# Altium project Ser.prjpcb
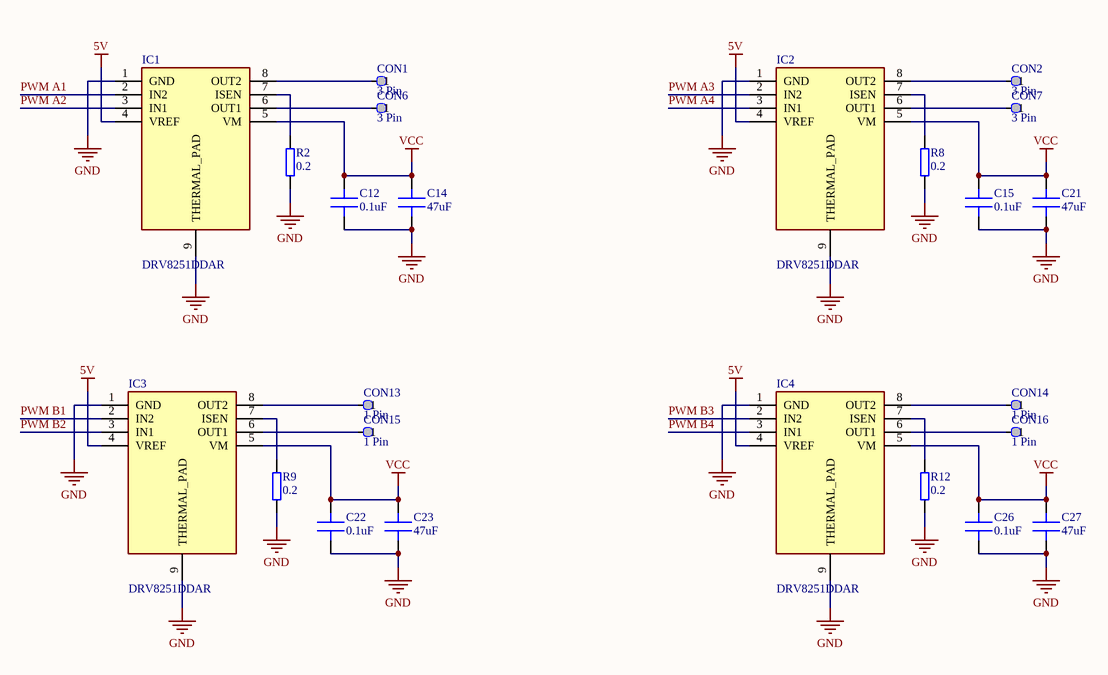
[diagram p0: dc_drivers.schdoc]
5 sheets, 110 parts. Net scope: global (net labels, ports and power ports of the same name join across sheets).
Board files: Ser_plytka.pcbdoc, v3.0_ser_plytka.PcbDoc
Sheets:
  dc_drivers.schdoc
  DC-DC.SchDoc
  Connectors-and-Filters.schdoc
  Interface1.schdoc
  MCU-and-ICs.schdoc

## Sheet dc_drivers.schdoc
size A4; SheetNumber: 1; SheetTotal: 5

### Parts
(Parts that share a designator on the sheet are numbered #1, #2 ... from top to bottom, then left to right.)
C12#1  0.1uF  [C 0402]
C14  47uF  [C 1206]
C15  0.1uF  [C 0402]
C21  47uF  [C 1206]
C22  0.1uF  [C 0402]
C23#1  47uF  [C 1206]
C26  0.1uF  [C 0402]
C27#1  47uF  [C 1206]
CON1  3 Pin  [SMD PAD]
CON2#1  3 Pin  [SMD PAD]
CON6  3 Pin  [SMD PAD]
CON7  3 Pin  [SMD PAD]
CON13  1 Pin  [SMD PAD]
CON14  1 Pin  [SMD PAD]
CON15  1 Pin  [SMD PAD]
CON16  1 Pin  [SMD PAD]
IC1#1  DRV8251DDAR  [SOIC127P600X170-9N]
IC2#1  DRV8251DDAR  [SOIC127P600X170-9N]
IC3  DRV8251DDAR  [SOIC127P600X170-9N]
IC4  DRV8251DDAR  [SOIC127P600X170-9N]
R2  0.2  [R 1206]
R8#1  0.2  [R 1206]
R9#1  0.2  [R 1206]
R12  0.2  [R 1206]

### Nets
5V: IC1#1.4(VREF) IC2#1.4(VREF) IC3.4(VREF) IC4.4(VREF)
GND: C12#1.2 C14.2 C15.2 C21.2 C22.2 C23#1.2 C26.2 C27#1.2 IC1#1.1(GND) IC1#1.9(THERMAL_PAD) IC2#1.1(GND) IC2#1.9(THERMAL_PAD) IC3.1(GND) IC3.9(THERMAL_PAD) IC4.1(GND) IC4.9(THERMAL_PAD) R2.2 R8#1.2 R9#1.2 R12.2
VCC: C12#1.1 C14.1 C15.1 C21.1 C22.1 C23#1.1 C26.1 C27#1.1 IC1#1.5(VM) IC2#1.5(VM) IC3.5(VM) IC4.5(VM)
PWM A1: IC1#1.2(IN2)
PWM A2: IC1#1.3(IN1)
PWM A3: IC2#1.2(IN2)
PWM A4: IC2#1.3(IN1)
PWM B1: IC3.2(IN2)
PWM B2: IC3.3(IN1)
PWM B3: IC4.2(IN2)
PWM B4: IC4.3(IN1)
NetCON1_1: CON1.1 IC1#1.8(OUT2)
NetCON2#1_1: CON2#1.1 IC2#1.8(OUT2)
NetCON6_1: CON6.1 IC1#1.6(OUT1)
NetCON7_1: CON7.1 IC2#1.6(OUT1)
NetCON13_1: CON13.1 IC3.8(OUT2)
NetCON14_1: CON14.1 IC4.8(OUT2)
NetCON15_1: CON15.1 IC3.6(OUT1)
NetCON16_1: CON16.1 IC4.6(OUT1)
NetIC1#1_7: IC1#1.7(ISEN) R2.1
NetIC2#1_7: IC2#1.7(ISEN) R8#1.1
NetIC3_7: IC3.7(ISEN) R9#1.1
NetIC4_7: IC4.7(ISEN) R12.1

### Library data of the parts
C12#1 C14 C15 C21 C22 C23#1 C26 C27#1 = Capacitor: MLCC Capacitor
CON1 CON2#1 CON6 CON7 = 1 Pin
IC1#1 IC2#1 IC3 IC4 = DRV8251DDAR: Integrated Circuit; Manufacturer_Name: Texas Instruments; Datasheet Link: https://www.arrow.com/en/products/drv8251ddar/texas-instruments?region=nac; Height: 1.7mm; Manufacturer_Part_Number: DRV8251DDAR; Mouser Part Number: 595-DRV8251DDAR; Mouser Price/Stock: https://www.mouser.co.uk/ProductDetail/Texas-Instruments/DRV8251DDAR?qs=doiCPypUmgHTzZyfapGahQ%3D%3D; Arrow Part Number: DRV8251DDAR; Arrow Price/Stock: https://www.arrow.com/en/products/drv8251ddar/texas-instruments?region=nac
R2 R8#1 R9#1 R12 = Resistor: General pourpouse resistor

## Sheet DC-DC.SchDoc
size A4; SheetNumber: 2; SheetTotal: 5
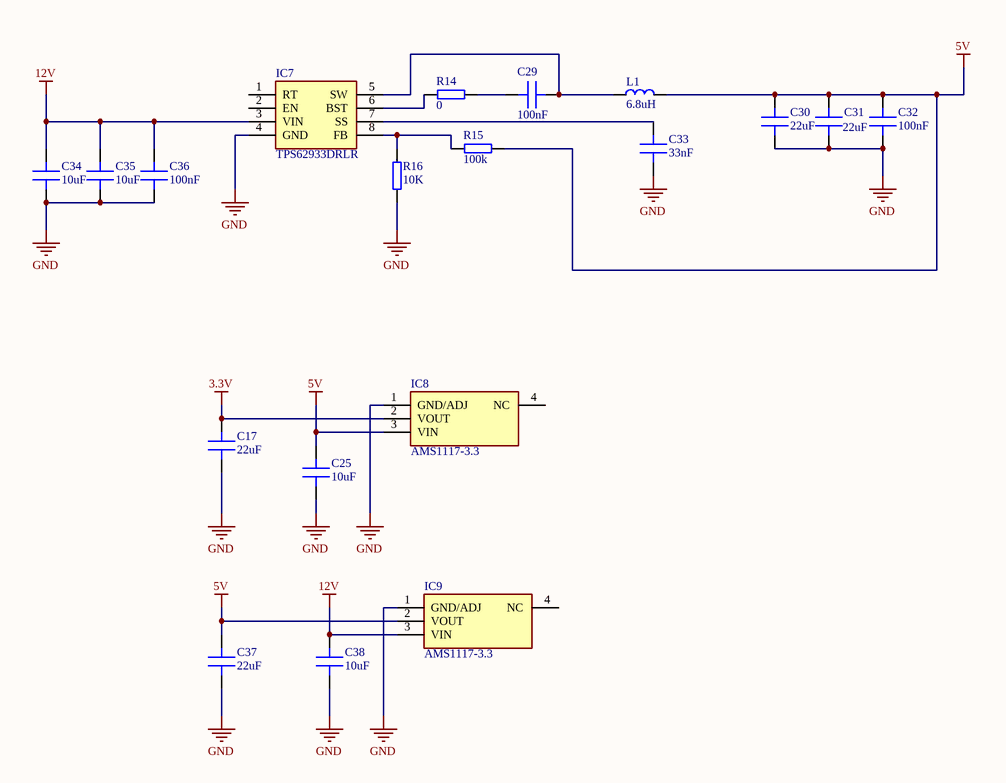
[diagram p1: DC-DC.SchDoc]

### Parts
(Parts that share a designator on the sheet are numbered #1, #2 ... from top to bottom, then left to right.)
C17#1  22uF  [C 0805]
C25#1  10uF  [C 0805]
C29  100nF  [C 0402]
C30  22uF  [C 1206]
C31  22uF  [C 1206]
C32  100nF  [C 0603]
C33  33nF  [C 0402]
C34#1  10uF  [C 1206]
C35#1  10uF  [C 1206]
C36#1  100nF  [C 0603]
C37  22uF  [C 0805]
C38  10uF  [C 0805]
IC7#1  TPS62933DRLR  [SOTFL50P160X60-8N]
IC8  AMS1117-3.3  [SOT229P700X180-4N]
IC9#1  AMS1117-3.3  [SOT229P700X180-4N]
L1#1  6.8uH  [HPI0630]
R14#1  0  [R 0402]
R15  100k  [R 0402]
R16  10K  [R 0402]

### Nets
3.3V: C17#1.1 IC8.2(VOUT)
5V: C25#1.1 C30.1 C31.1 C32.1 C37.1 IC8.3(VIN) IC9#1.2(VOUT) L1#1.2 R15.1
12V: C34#1.1 C35#1.1 C36#1.1 C38.1 IC7#1.3(VIN) IC9#1.3(VIN)
GND: C17#1.2 C25#1.2 C30.2 C31.2 C32.2 C33.2 C34#1.2 C35#1.2 C36#1.2 C37.2 C38.2 IC7#1.4(GND) IC8.1(GND/ADJ) IC9#1.1(GND/ADJ) R16.1
NetC29_1: C29.1 R14#1.1
NetC29_2: C29.2 IC7#1.5(SW) L1#1.1
NetC33_1: C33.1 IC7#1.7(SS)
NetIC7#1_6: IC7#1.6(BST) R14#1.2
NetIC7#1_8: IC7#1.8(FB) R15.2 R16.2

Not connected (* = marked no-connect by the designer): IC7#1 1(RT) 2(EN); IC8 4(NC); IC9#1 4(NC)

### Library data of the parts
C17#1 C25#1 C29-C33 C34#1 C35#1 C36#1 C37 C38 = Capacitor: MLCC Capacitor
IC7#1 = TPS62933DRLR: Integrated Circuit; Manufacturer_Name: Texas Instruments; Datasheet Link: https://www.ti.com/lit/ds/symlink/tps62933.pdf?ts=1626073394234; Height: 0.6mm; Manufacturer_Part_Number: TPS62933DRLR; Mouser Part Number: 595-TPS62933DRLR; Mouser Price/Stock: https://www.mouser.co.uk/ProductDetail/Texas-Instruments/TPS62933DRLR?qs=Rp5uXu7WBW9fv47wfQVntQ%3D%3D; Arrow Part Number: TPS62933DRLR; Arrow Price/Stock: https://www.arrow.com/en/products/tps62933drlr/texas-instruments?utm_currency=USD&region=nac
IC8 IC9#1 = AMS1117-3.3: Integrated Circuit; Manufacturer_Name: Advanced; Datasheet Link: https://datasheet.datasheetarchive.com/originals/distributors/Datasheets-28/DSA-550594.pdf; Height: 1.8mm; Manufacturer_Part_Number: AMS1117-3.3
L1#1 = Inductor: General pourpouse inductor
R14#1 R15 R16 = Resistor: General pourpouse resistor

## Sheet Connectors-and-Filters.schdoc
size A4; SheetNumber: 3; SheetTotal: 5
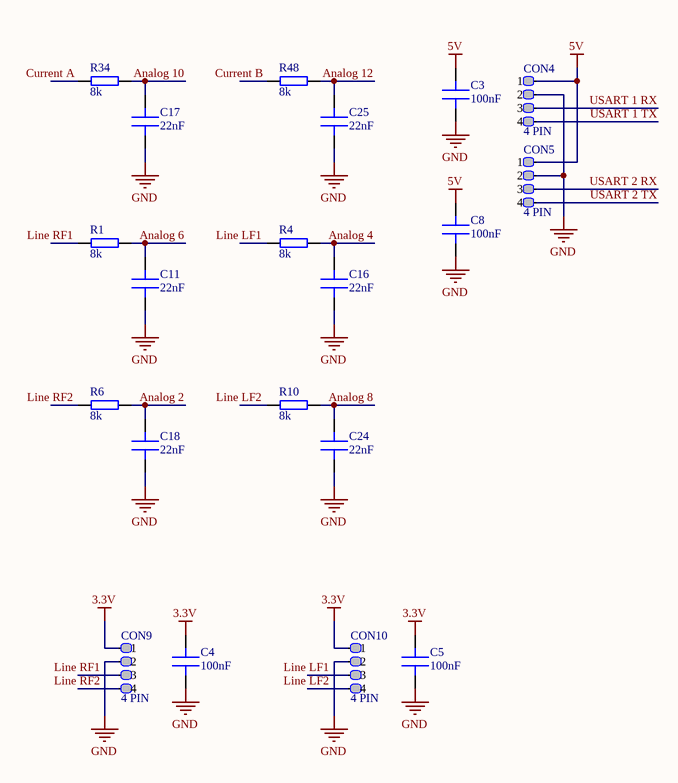
[diagram p2: Connectors-and-Filters.schdoc]

### Parts
(Parts that share a designator on the sheet are numbered #1, #2 ... from top to bottom, then left to right.)
C3  100nF  [C 0402]
C4  100nF  [C 0402]
C5  100nF  [C 0402]
C8  100nF  [C 0402]
C11  22nF  [C 0402]
C16  22nF  [C 0402]
C17#2  22nF  [C 0402]
C18  22nF  [C 0402]
C24  22nF  [C 0402]
C25#2  22nF  [C 0402]
CON4  4 PIN  [BM04B-SRSS-TB]
CON5  4 PIN  [BM04B-SRSS-TB]
CON9  4 PIN  [SM04B-SRSS-TB]
CON10  4 PIN  [SM04B-SRSS-TB]
R1  8k  [R 0402]
R4  8k  [R 0402]
R6  8k  [R 0402]
R10  8k  [R 0402]
R34  8k  [R 0402]
R48  8k  [R 0402]

### Nets
3.3V: C4.1 C5.1 CON9.1 CON10.1
5V: C3.1 C8.1 CON4.1 CON5.1
GND: C3.2 C4.2 C5.2 C8.2 C11.2 C16.2 C17#2.2 C18.2 C24.2 C25#2.2 CON4.2 CON5.2 CON9.2 CON10.2
Analog 2: C18.1 R6.1
Analog 4: C16.1 R4.1
Analog 6: C11.1 R1.1
Analog 8: C24.1 R10.1
Analog 10: C17#2.1 R34.1
Analog 12: C25#2.1 R48.1
Current A: R34.2
Current B: R48.2
Line LF1: CON10.3 R4.2
Line LF2: CON10.4 R10.2
Line RF1: CON9.3 R1.2
Line RF2: CON9.4 R6.2
USART 1 RX: CON4.3
USART 1 TX: CON4.4
USART 2 RX: CON5.3
USART 2 TX: CON5.4

### Library data of the parts
C3-C5 C8 C11 C16 C17#2 C18 C24 C25#2 = Capacitor: MLCC Capacitor
R1 R4 R6 R10 R34 R48 = Resistor: General pourpouse resistor

## Sheet Interface1.schdoc
size A4; SheetNumber: 4; SheetTotal: 5
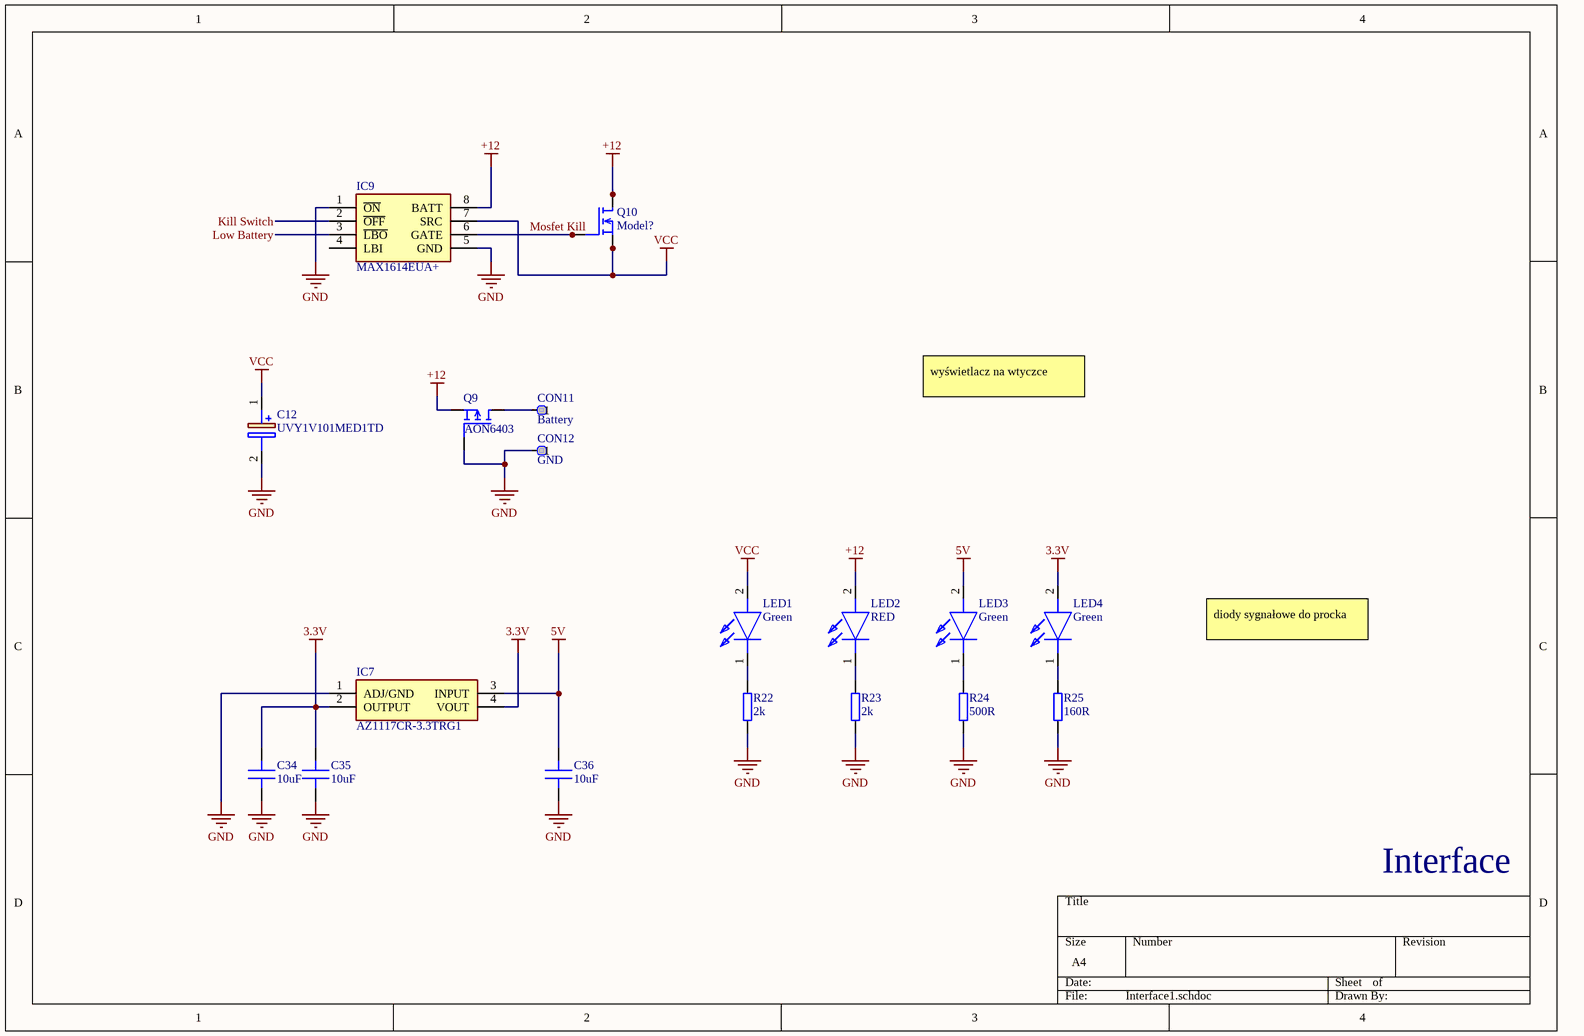
[diagram p3: Interface1.schdoc]

### Parts
(Parts that share a designator on the sheet are numbered #1, #2 ... from top to bottom, then left to right.)
C12#2  UVY1V101MED1TD  [CAPPRD250W50D655H1250]
C34#2  10uF  [C 0805]
C35#2  10uF  [C 0805]
C36#2  10uF  [C 0805]
CON11  Battery  [SMD PAD]
CON12  GND  [SMD PAD]
IC7#2  AZ1117CR-3.3TRG1  [AZ1117CR33TRG1]
IC9#2  MAX1614EUA+  [SOP65P490X110-8N]
LED1  Green  [LEDC1608X50N]
LED2  RED  [LEDC1608X50N]
LED3  Green  [LEDC1608X50N]
LED4  Green  [LEDC1608X50N]
Q9  AON6403  [DFN 5x6]
Q10  Model?  [DFN 5x6]
R22  2k  [R 0402]
R23  2k  [R 0402]
R24  500R  [R 0402]
R25  160R  [R 0402]

### Nets
3.3V: C34#2.1 C35#2.1 IC7#2.2(OUTPUT) IC7#2.4(VOUT) LED4.2(A)
5V: C36#2.1 IC7#2.3(INPUT) LED3.2(A)
+12: IC9#2.8(BATT) LED2.2(A) Q9.1,_2,_3(S) Q10.5_8(D)
GND: C12#2.2(-) C34#2.2 C35#2.2 C36#2.2 CON12.1 IC7#2.1(ADJ/GND) IC9#2.1(~{ON}) IC9#2.5(GND) Q9.4(G) R22.2 R23.2 R24.2 R25.2
VCC: C12#2.1(+) IC9#2.7(SRC) LED1.2(A) Q10.1,2,3(S) Q10.1,_2,_3(S)
Kill Switch: IC9#2.2(~{OFF})
Low Battery: IC9#2.3(~{LBO})
Mosfet Kill: IC9#2.6(GATE) Q10.4(G)
NetCON11_1: CON11.1 Q9.5_8(D)
NetLED1_1: LED1.1(K) R22.1
NetLED2_1: LED2.1(K) R23.1
NetLED3_1: LED3.1(K) R24.1
NetLED4_1: LED4.1(K) R25.1

Not connected (* = marked no-connect by the designer): IC9#2 4(LBI)

### Notes on the sheet
- wyświetlacz na wtyczce
- diody sygnałowe do procka
- Interface

### Library data of the parts
C12#2 = UVY1V101MED1TD: Capacitor Polarised; Manufacturer_Name: Nichicon; Datasheet Link: http://nichicon-us.com/english/products/pdfs/e-uvy.pdf; Height: 12.5mm; Manufacturer_Part_Number: UVY1V101MED1TD; Arrow Part Number: UVY1V101MED1TD; Arrow Price/Stock: https://www.arrow.com/en/products/uvy1v101med1td/nichicon
C34#2 C35#2 C36#2 = Capacitor: MLCC Capacitor
CON11 CON12 = 1 Pin
IC7#2 = AZ1117CR-3.3TRG1: Integrated Circuit; Manufacturer_Name: Diodes Inc.; Datasheet Link: https://www.diodes.com/assets/Datasheets/AZ1117C.pdf; Height: 2mm; Manufacturer_Part_Number: AZ1117CR-3.3TRG1; Mouser Part Number: 621-AZ1117CR-3.3TRG1; Mouser Price/Stock: https://www.mouser.co.uk/ProductDetail/Diodes-Incorporated/AZ1117CR-3.3TRG1?qs=FKu9oBikfSlEg7waHw2tMw%3D%3D; Arrow Part Number: AZ1117CR-3.3TRG1; Arrow Price/Stock: https://www.arrow.com/en/products/az1117cr-3.3trg1/diodes-incorporated?region=nac
IC9#2 = MAX1614EUA+: Integrated Circuit; Manufacturer_Name: Maxim Integrated; Datasheet Link: http://datasheets.maximintegrated.com/en/ds/MAX1614.pdf; Height: 1.1mm; Manufacturer_Part_Number: MAX1614EUA+; Mouser Part Number: 700-MAX1614EUA; Mouser Price/Stock: https://www.mouser.co.uk/ProductDetail/Maxim-Integrated/MAX1614EUA%2b?qs=1THa7WoU59FiDBRRbRrFJA%3D%3D
LED1-LED4 = 150060GS55040: LED; Manufacturer_Name: Wurth Elektronik; Datasheet Link: https://katalog.we-online.de/led/datasheet/150060GS55040.pdf; Height: 0.5mm; Manufacturer_Part_Number: 150060GS55040; Mouser Part Number: 710-150060GS55040; Mouser Price/Stock: https://www.mouser.co.uk/ProductDetail/Wurth-Elektronik/150060GS55040?qs=fAHHVMwC%252Bbhr5Aln2oA6Nw%3D%3D
Q9 = AON6403: P-Mosfet 30V 67A Rds(on) 3.1mR
Q10 = Power MOSFET: N-Mosfet DFN 5x6
R22-R25 = Resistor: General pourpouse resistor

## Sheet MCU-and-ICs.schdoc
size A4; SheetNumber: 5; SheetTotal: 5
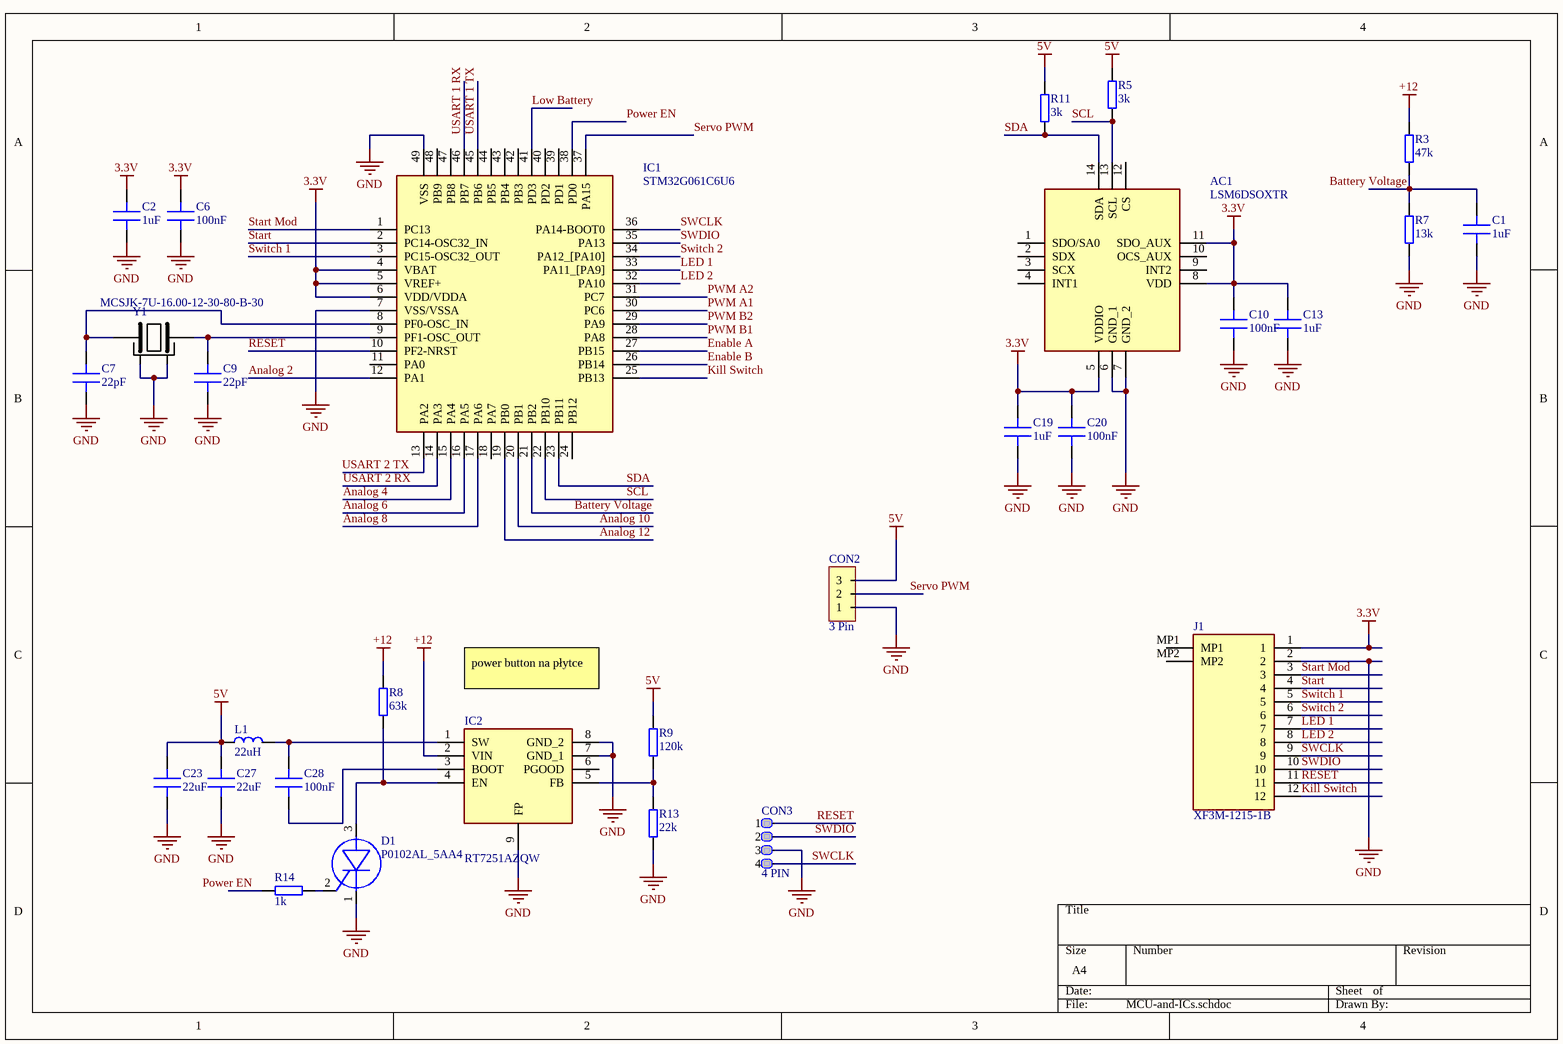
[diagram p4: MCU-and-ICs.schdoc]

### Parts
(Parts that share a designator on the sheet are numbered #1, #2 ... from top to bottom, then left to right.)
AC1  LSM6DSOXTR  [LGA-14_1]
C1  1uF  [C 0402]
C2  1uF  [C 0402]
C6  100nF  [C 0402]
C7  22pF  [C 0402]
C9  22pF  [C 0402]
C10  100nF  [C 0402]
C13  1uF  [C 0402]
C19  1uF  [C 0402]
C20  100nF  [C 0402]
C23#2  22uF  [C 0805]
C27#2  22uF  [C 0805]
C28  100nF  [C 0402]
CON2#2  3 Pin  [BM03B-SRSS-TB]
CON3  4 PIN  [SM04B-SRSS-TB]
D1  P0102AL_5AA4  [SOT95P255X140-3N]
IC1#2  STM32G061C6U6  [QFN50P700X700X65-49N-D]
IC2#2  RT7251AZQW  [SON50P200X200X80-9N-D]
J1  XF3M-1215-1B  [XF3M12151B]
L1#2  22uH  [HPI0630]
R3  47k  [R 0402]
R5  3k  [R 0402]
R7  13k  [R 0402]
R8#2  63k  [R 0402]
R9#2  120k  [R 0402]
R11  3k  [R 0402]
R13  22k  [R 0402]
R14#2  1k  [R 0402]
Y1  MCSJK-7U-16.00-12-30-80-B-30  [MCSJK7U1600123080B30]

### Nets
3.3V: AC1.5(VDDIO) AC1.8(VDD) AC1.11(SDO_AUX) C2.1 C6.1 C10.1 C13.1 C19.1 C20.1 IC1#2.4(VBAT) IC1#2.5(VREF+) IC1#2.6(VDD/VDDA) J1.1
5V: C23#2.1 C27#2.1 CON2#2.3 L1#2.1 R5.2 R9#2.2 R11.2
+12: IC2#2.2(VIN) R3.2 R8#2.2
GND: AC1.6(GND_1) AC1.7(GND_2) C1.2 C2.2 C6.2 C7.2 C9.2 C10.2 C13.2 C19.2 C20.2 C23#2.2 C27#2.2 CON2#2.1 CON3.3 D1.1(K) IC1#2.7(VSS/VSSA) IC1#2.49(VSS) IC2#2.7(GND_1) IC2#2.8(GND_2) IC2#2.9(FP) J1.2 R7.1 R13.1 Y1.2(GND_1) Y1.4(GND_2)
Analog 2: IC1#2.12(PA1)
Analog 4: IC1#2.15(PA4)
Analog 6: IC1#2.16(PA5)
Analog 8: IC1#2.17(PA6)
Analog 10: IC1#2.20(PB1)
Analog 12: IC1#2.19(PB0)
Battery Voltage: C1.1 IC1#2.21(PB2) R3.1 R7.2
Enable A: IC1#2.27(PB15)
Enable B: IC1#2.26(PB14)
Kill Switch: IC1#2.25(PB13) J1.12
LED 1: IC1#2.33(PA11_[PA9]) J1.7
LED 2: IC1#2.32(PA10) J1.8
Low Battery: IC1#2.41(PD3)
Power EN: IC1#2.38(PD0) R14#2.2
PWM A1: IC1#2.30(PC6)
PWM A2: IC1#2.31(PC7)
PWM B1: IC1#2.28(PA8)
PWM B2: IC1#2.29(PA9)
RESET: CON3.1 IC1#2.10(PF2-NRST) J1.11
SCL: AC1.13(SCL) IC1#2.22(PB10) R5.1
SDA: AC1.14(SDA) IC1#2.23(PB11) R11.1
Servo PWM: CON2#2.2 IC1#2.37(PA15)
Start: IC1#2.2(PC14-OSC32_IN) J1.4
Start Mod: IC1#2.1(PC13) J1.3
SWCLK: CON3.4 IC1#2.36(PA14-BOOT0) J1.9
SWDIO: CON3.2 IC1#2.35(PA13) J1.10
Switch 1: IC1#2.3(PC15-OSC32_OUT) J1.5
Switch 2: IC1#2.34(PA12_[PA10]) J1.6
USART 1 RX: IC1#2.46(PB7)
USART 1 TX: IC1#2.45(PB6)
USART 2 RX: IC1#2.14(PA3)
USART 2 TX: IC1#2.13(PA2)
NetC7_1: C7.1 IC1#2.8(PF0-OSC_IN) Y1.1(CRYSTAL_1)
NetC9_1: C9.1 IC1#2.9(PF1-OSC_OUT) Y1.3(CRYSTAL_2)
NetC28_1: C28.1 IC2#2.1(SW) L1#2.2
NetC28_2: C28.2 IC2#2.3(BOOT)
NetD1_2: D1.2(G) R14#2.1
NetD1_3: D1.3(A) IC2#2.4(EN) R8#2.1
NetIC2#2_5: IC2#2.5(FB) R9#2.1 R13.2

Not connected (* = marked no-connect by the designer): AC1 1(SDO/SA0) 2(SDX) 3(SCX) 4(INT1) 9(INT2) 10(OCS_AUX) 12(CS); IC1#2 11(PA0) 18(PA7) 24(PB12) 39(PD1) 40(PD2) 42(PB3) 43(PB4) 44(PB5) 47(PB8) 48(PB9); IC2#2 6(PGOOD); J1 MP1 MP2

### Notes on the sheet
- power button na płytce

### Library data of the parts
AC1 = LSM6DSOXTR: Accelerometer; Manufacturer_Name: STMicroelectronics; Datasheet Link: https://www.st.com/resource/en/datasheet/lsm6dsox.pdf; Manufacturer_Part_Number: LSM6DSOXTR; Mouser Part Number: 511-LSM6DSOXTR; Mouser Price/Stock: https://www.mouser.co.uk/ProductDetail/STMicroelectronics/LSM6DSOXTR?qs=l7cgNqFNU1i9dcjzItLpVQ%3D%3D; Arrow Part Number: LSM6DSOXTR; Arrow Price/Stock: https://www.arrow.com/en/products/lsm6dsoxtr/stmicroelectronics
C1 C2 C6 C7 C9 C10 C13 C19 C20 C23#2 C27#2 C28 = Capacitor: MLCC Capacitor
D1 = P0102AL_5AA4: SCR; Manufacturer_Name: STMicroelectronics; Manufacturer_Part_Number: P0102AL 5AA4; Datasheet Link: https://www.st.com/resource/en/datasheet/p0102al.pdf; Height: 1.4mm; Mouser Part Number: 511-P0102AL; Mouser Price/Stock: https://www.mouser.co.uk/ProductDetail/STMicroelectronics/P0102AL-5AA4/?qs=PjVWedEN3CRKQvFRu1Tr6Q%3D%3D; Arrow Part Number: P0102AL 5AA4; Arrow Price/Stock: https://www.arrow.com/en/products/p0102al5aa4/stmicroelectronics
IC1#2 = STM32G061C6U6: Integrated Circuit; Manufacturer_Name: STMicroelectronics; Datasheet Link: https://www.st.com/resource/en/datasheet/stm32g061c6.pdf; Height: 0.65mm; Manufacturer_Part_Number: STM32G061C6U6; Mouser Part Number: 511-STM32G061C6U6; Mouser Price/Stock: https://www.mouser.co.uk/ProductDetail/STMicroelectronics/STM32G061C6U6?qs=CiayqK2gdcKUDq0OUzUqqg%3D%3D
IC2#2 = RT7251AZQW: Integrated Circuit; Manufacturer_Name: RICHTEK; Datasheet Link: https://componentsearchengine.com/Datasheets/2/RT7251AZQW.pdf; Height: 0.8mm; Manufacturer_Part_Number: RT7251AZQW
J1 = XF3M-1215-1B: Connector; Manufacturer_Name: Omron Electronics; Datasheet Link: https://datasheet.lcsc.com/szlcsc/Omron-Electronics-XF3M-1215-1B_C231431.pdf; Height: 2mm; Manufacturer_Part_Number: XF3M-1215-1B; Mouser Part Number: 653-XF3M-1215-1B; Mouser Price/Stock: https://www.mouser.co.uk/ProductDetail/Omron-Electronics/XF3M-1215-1B?qs=1He0yLMpldAQYeSJcjbchQ%3D%3D; Arrow Part Number: XF3M-1215-1B; Arrow Price/Stock: https://www.arrow.com/en/products/xf3m-1215-1b/omron
L1#2 = Inductor: General pourpouse inductor
R3 R5 R7 R8#2 R9#2 R11 R13 R14#2 = Resistor: General pourpouse resistor
Y1 = MCSJK-7U-16.00-12-30-80-B-30: Crystal or Oscillator; Manufacturer_Name: MULTICOMP; Datasheet Link: https://www.farnell.com/datasheets/2864166.pdf; Height: 0.8mm; Manufacturer_Part_Number: MCSJK-7U-16.00-12-30-80-B-30

## Nets that join several sheets
3.3V: DC-DC (C17#1.1 IC8.2), Connectors-and-Filters (C4.1 C5.1 CON9.1 CON10.1), Interface1 (5 pins), MCU-and-ICs (13 pins)
5V: dc_drivers (IC1#1.4 IC2#1.4 IC3.4 IC4.4), DC-DC (9 pins), Connectors-and-Filters (C3.1 C8.1 CON4.1 CON5.1), Interface1 (C36#2.1 IC7#2.3 LED3.2), MCU-and-ICs (7 pins)
+12: Interface1 (IC9#2.8 LED2.2 Q9.1, 2, 3 Q10.5_8), MCU-and-ICs (IC2#2.2 R3.2 R8#2.2)
GND: dc_drivers (20 pins), DC-DC (15 pins), Connectors-and-Filters (14 pins), Interface1 (13 pins), MCU-and-ICs (26 pins)
VCC: dc_drivers (12 pins), Interface1 (5 pins)
Analog 2: Connectors-and-Filters (C18.1 R6.1), MCU-and-ICs (IC1#2.12)
Analog 4: Connectors-and-Filters (C16.1 R4.1), MCU-and-ICs (IC1#2.15)
Analog 6: Connectors-and-Filters (C11.1 R1.1), MCU-and-ICs (IC1#2.16)
Analog 8: Connectors-and-Filters (C24.1 R10.1), MCU-and-ICs (IC1#2.17)
Analog 10: Connectors-and-Filters (C17#2.1 R34.1), MCU-and-ICs (IC1#2.20)
Analog 12: Connectors-and-Filters (C25#2.1 R48.1), MCU-and-ICs (IC1#2.19)
Kill Switch: Interface1 (IC9#2.2), MCU-and-ICs (IC1#2.25 J1.12)
Low Battery: Interface1 (IC9#2.3), MCU-and-ICs (IC1#2.41)
PWM A1: dc_drivers (IC1#1.2), MCU-and-ICs (IC1#2.30)
PWM A2: dc_drivers (IC1#1.3), MCU-and-ICs (IC1#2.31)
PWM B1: dc_drivers (IC3.2), MCU-and-ICs (IC1#2.28)
PWM B2: dc_drivers (IC3.3), MCU-and-ICs (IC1#2.29)
USART 1 RX: Connectors-and-Filters (CON4.3), MCU-and-ICs (IC1#2.46)
USART 1 TX: Connectors-and-Filters (CON4.4), MCU-and-ICs (IC1#2.45)
USART 2 RX: Connectors-and-Filters (CON5.3), MCU-and-ICs (IC1#2.14)
USART 2 TX: Connectors-and-Filters (CON5.4), MCU-and-ICs (IC1#2.13)